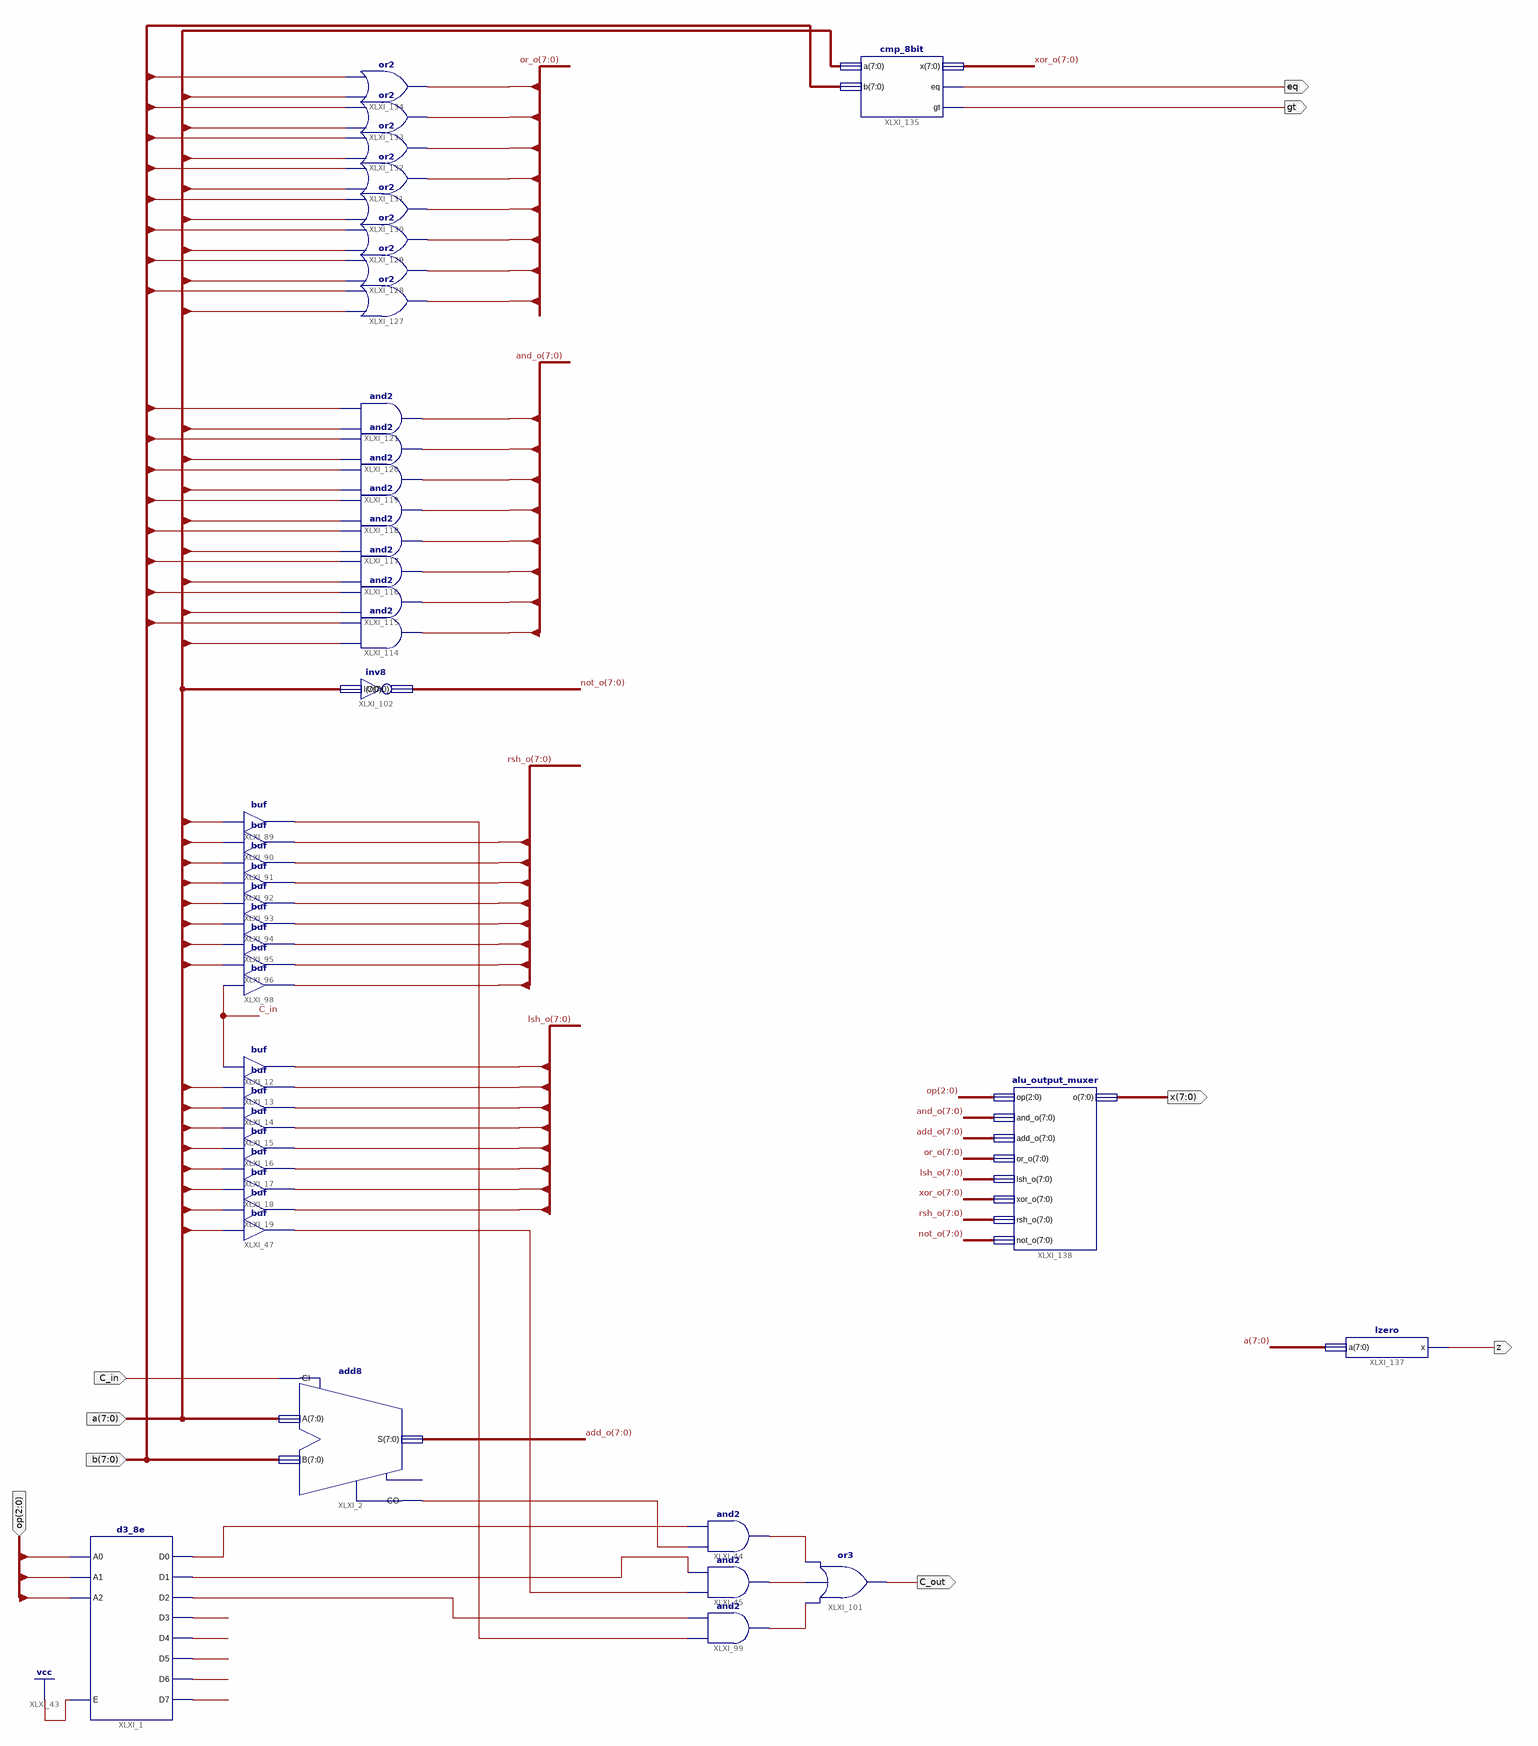
[diagram p0: schematic sheet 1]
// Xilinx ISE schematic alu.sch (aspartan6) as structural Verilog: 44 symbols, 9 ports
module alu (
  input  [7:0] b,
  input  C_in,
  input  [7:0] a,
  input  [2:0] op,
  output C_out,
  output eq,
  output gt,
  output z,
  output [7:0] x
);

  wire XLXN_8, XLXN_91, XLXN_93, XLXN_105, XLXN_191, XLXN_192, XLXN_199, XLXN_201, XLXN_202, XLXN_223,
       XLXN_224, XLXN_225, XLXN_226, XLXN_227;
  wire [7:0] add_o, and_o, lsh_o, not_o, or_o, rsh_o, xor_o;

  d3_8e XLXI_1 (
    .A0(op[0]), .A1(op[1]), .A2(op[2]), .E(1'b1), .D0(XLXN_8), .D1(XLXN_105), .D2(XLXN_192), .D3(XLXN_223),
    .D4(XLXN_224), .D5(XLXN_225), .D6(XLXN_226), .D7(XLXN_227));
  add8 XLXI_2 (.A(a), .B(b), .CI(C_in), .CO(XLXN_91), .S(add_o));  // open: OFL
  buf XLXI_13 (lsh_o[1], a[0]);
  buf XLXI_14 (lsh_o[2], a[1]);
  buf XLXI_15 (lsh_o[3], a[2]);
  buf XLXI_16 (lsh_o[4], a[3]);
  buf XLXI_17 (lsh_o[5], a[4]);
  buf XLXI_18 (lsh_o[6], a[5]);
  buf XLXI_12 (lsh_o[0], C_in);
  and XLXI_44 (XLXN_199, XLXN_91, XLXN_8);
  and XLXI_45 (XLXN_202, XLXN_93, XLXN_105);
  buf XLXI_19 (lsh_o[7], a[6]);
  buf XLXI_47 (XLXN_93, a[7]);
  buf XLXI_89 (XLXN_191, a[0]);
  buf XLXI_90 (rsh_o[0], a[1]);
  buf XLXI_91 (rsh_o[1], a[2]);
  buf XLXI_92 (rsh_o[2], a[3]);
  buf XLXI_93 (rsh_o[3], a[4]);
  buf XLXI_94 (rsh_o[4], a[5]);
  buf XLXI_95 (rsh_o[5], a[6]);
  buf XLXI_96 (rsh_o[6], a[7]);
  buf XLXI_98 (rsh_o[7], C_in);
  and XLXI_99 (XLXN_201, XLXN_191, XLXN_192);
  or XLXI_101 (C_out, XLXN_201, XLXN_202, XLXN_199);
  inv8 XLXI_102 (.I(a), .O(not_o));
  and XLXI_114 (and_o[7], a[7], b[7]);
  and XLXI_115 (and_o[6], a[6], b[6]);
  and XLXI_116 (and_o[5], a[5], b[5]);
  and XLXI_117 (and_o[4], a[4], b[4]);
  and XLXI_118 (and_o[3], a[3], b[3]);
  and XLXI_119 (and_o[2], a[2], b[2]);
  and XLXI_120 (and_o[1], a[1], b[1]);
  and XLXI_121 (and_o[0], a[0], b[0]);
  or XLXI_127 (or_o[7], a[7], b[7]);
  or XLXI_128 (or_o[6], a[6], b[6]);
  or XLXI_129 (or_o[5], a[5], b[5]);
  or XLXI_130 (or_o[4], a[4], b[4]);
  or XLXI_131 (or_o[3], a[3], b[3]);
  or XLXI_132 (or_o[2], a[2], b[2]);
  or XLXI_133 (or_o[1], a[1], b[1]);
  or XLXI_134 (or_o[0], a[0], b[0]);
  cmp_8bit XLXI_135 (.a(a), .b(b), .eq(eq), .gt(gt), .x(xor_o));
  lzero XLXI_137 (.a(a), .x(z));
  alu_output_muxer XLXI_138 (
    .add_o(add_o), .and_o(and_o), .lsh_o(lsh_o), .not_o(not_o), .o(x), .op(op), .or_o(or_o), .rsh_o(rsh_o),
    .xor_o(xor_o));
endmodule
